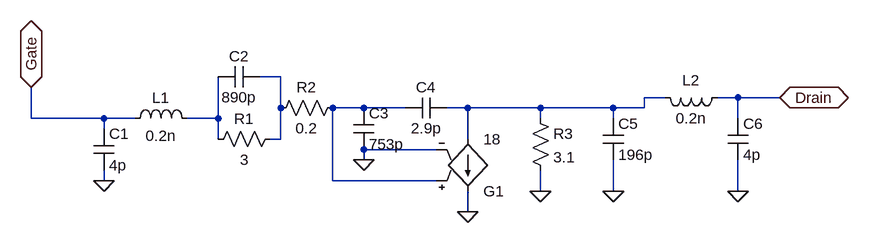
[diagram p0: schematic MRFX1k80Hhalf.asc]
MRFX1k80Hhalf.asc, the LTspice schematic file:
Version 4
SHEET 1 1228 680
WIRE 336 48 304 48
WIRE 928 80 896 80
WIRE 1040 80 1008 80
WIRE 1104 80 1040 80
WIRE 336 96 336 48
WIRE 464 96 416 96
WIRE 528 96 464 96
WIRE 624 96 592 96
WIRE 736 96 624 96
WIRE 848 96 736 96
WIRE 896 96 896 80
WIRE 896 96 848 96
WIRE -48 112 -48 64
WIRE 64 112 -48 112
WIRE 112 112 64 112
WIRE 240 112 240 48
WIRE 240 112 192 112
WIRE 736 112 736 96
WIRE 848 112 848 96
WIRE 1040 112 1040 80
WIRE 64 128 64 112
WIRE 240 144 240 112
WIRE 336 144 336 96
WIRE 336 144 320 144
WIRE 624 144 624 96
WIRE 576 160 464 160
WIRE 464 176 464 160
WIRE 64 208 64 192
WIRE 416 208 416 96
WIRE 576 208 416 208
WIRE 736 224 736 192
WIRE 848 224 848 176
WIRE 1040 224 1040 176
WIRE 624 256 624 224
FLAG 64 208 0
FLAG 464 176 0
FLAG 624 256 0
FLAG 736 224 0
FLAG 848 224 0
FLAG 1040 224 0
FLAG -48 64 Gate
IOPIN -48 64 BiDir
FLAG 1104 80 Drain
IOPIN 1104 80 BiDir
SYMBOL cap 48 128 R0
SYMATTR InstName C1
SYMATTR Value 4p
SYMBOL ind 96 128 R270
WINDOW 0 32 56 VTop 2
WINDOW 3 5 56 VBottom 2
SYMATTR InstName L1
SYMATTR Value 0.2n
SYMBOL cap 304 32 R90
WINDOW 0 0 32 VBottom 2
WINDOW 3 32 32 VTop 2
SYMATTR InstName C2
SYMATTR Value 890p
SYMBOL res 336 128 R90
WINDOW 0 0 56 VBottom 2
WINDOW 3 32 56 VTop 2
SYMATTR InstName R1
SYMATTR Value 3
SYMBOL res 432 80 R90
WINDOW 0 0 56 VBottom 2
WINDOW 3 32 56 VTop 2
SYMATTR InstName R2
SYMATTR Value 0.2
SYMBOL cap 448 96 R0
SYMATTR InstName C3
SYMATTR Value 753p
SYMBOL cap 592 80 R90
WINDOW 0 0 32 VBottom 2
WINDOW 3 32 32 VTop 2
SYMATTR InstName C4
SYMATTR Value 2.9p
SYMBOL g 624 240 M180
SYMATTR InstName G1
SYMATTR Value 18
SYMBOL res 720 96 R0
SYMATTR InstName R3
SYMATTR Value 3.1
SYMBOL cap 832 112 R0
SYMATTR InstName C5
SYMATTR Value 196p
SYMBOL ind 1024 64 R90
WINDOW 0 5 56 VBottom 2
WINDOW 3 32 56 VTop 2
SYMATTR InstName L2
SYMATTR Value 0.2n
SYMBOL cap 1024 112 R0
SYMATTR InstName C6
SYMATTR Value 4p

The netlist it stands for:
* MRFX1k80Hhalf.asc
C1 Gate 0 4p
L1 Gate N004 0.2n
C2 N001 N004 890p
R1 N001 N004 3
R2 N003 N001 0.2
C3 N003 0 753p
C4 N002 N003 2.9p
G1 N002 0 N003 0 18
R3 N002 0 3.1
C5 N002 0 196p
L2 Drain N002 0.2n
C6 Drain 0 4p
.backanno
.end